# Altium schematic sheet LEDS.SchDoc: LEDBO - LTSN-N213EGBW (LEDS)
size B; Author: Sébastien Gélinas; Organization: SmartHalo; Address1: 5445 de Gaspé; Address2: Montréal, QC; Address3: Canada; Address4: H2T 3B2; Revision: 1; SheetNumber: 4; SheetTotal: 4
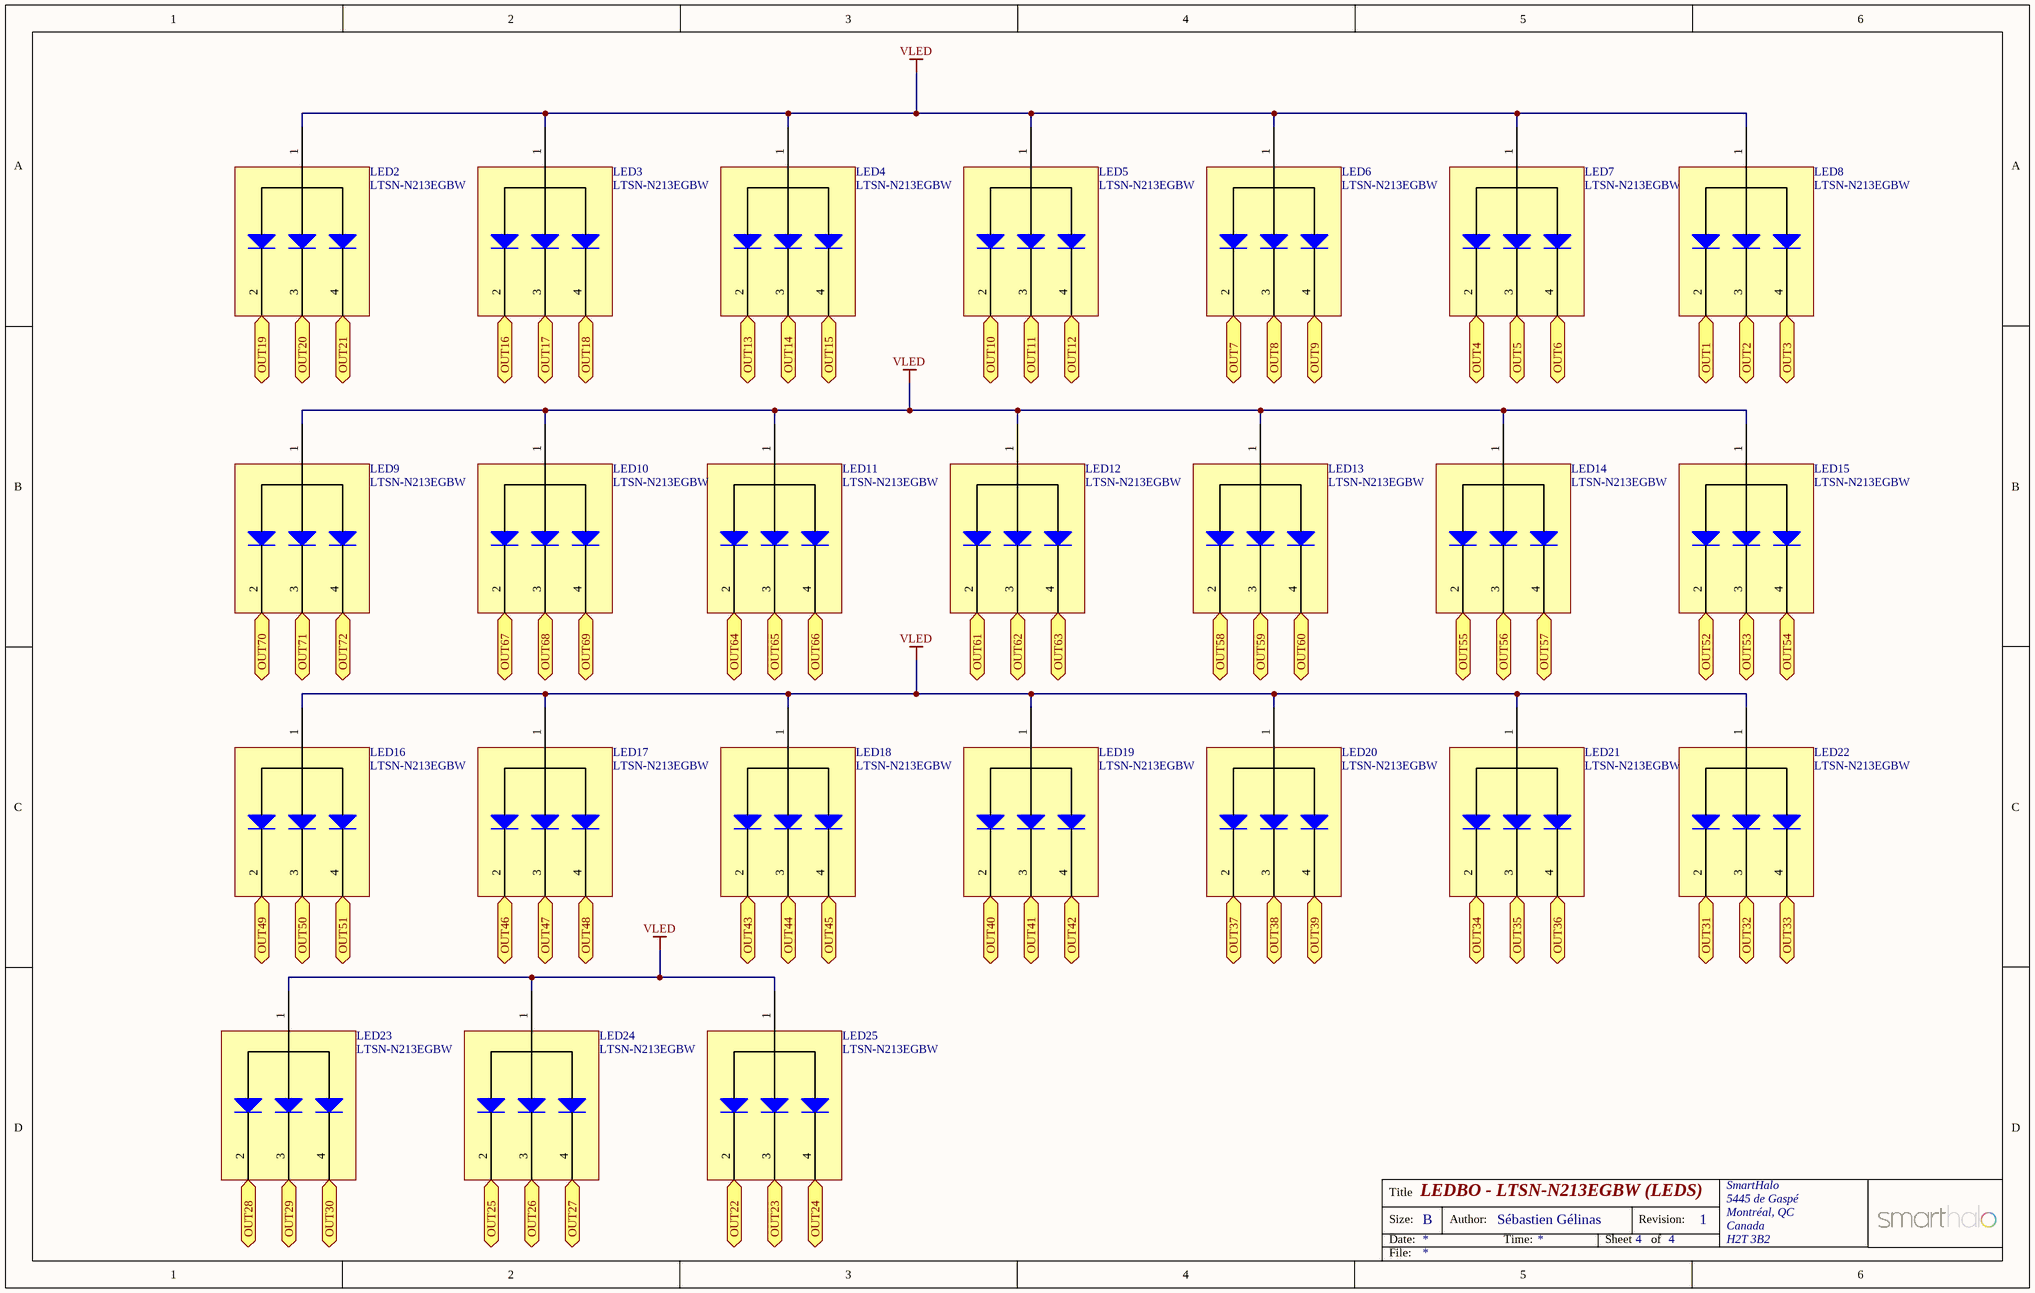
[diagram p0: LEDS.SchDoc]

## Parts
LED2  LTSN-N213EGBW  [LTSN-N213EGBW]
LED3  LTSN-N213EGBW  [LTSN-N213EGBW]
LED4  LTSN-N213EGBW  [LTSN-N213EGBW]
LED5  LTSN-N213EGBW  [LTSN-N213EGBW]
LED6  LTSN-N213EGBW  [LTSN-N213EGBW]
LED7  LTSN-N213EGBW  [LTSN-N213EGBW]
LED8  LTSN-N213EGBW  [LTSN-N213EGBW]
LED9  LTSN-N213EGBW  [LTSN-N213EGBW]
LED10  LTSN-N213EGBW  [LTSN-N213EGBW]
LED11  LTSN-N213EGBW  [LTSN-N213EGBW]
LED12  LTSN-N213EGBW  [LTSN-N213EGBW]
LED13  LTSN-N213EGBW  [LTSN-N213EGBW]
LED14  LTSN-N213EGBW  [LTSN-N213EGBW]
LED15  LTSN-N213EGBW  [LTSN-N213EGBW]
LED16  LTSN-N213EGBW  [LTSN-N213EGBW]
LED17  LTSN-N213EGBW  [LTSN-N213EGBW]
LED18  LTSN-N213EGBW  [LTSN-N213EGBW]
LED19  LTSN-N213EGBW  [LTSN-N213EGBW]
LED20  LTSN-N213EGBW  [LTSN-N213EGBW]
LED21  LTSN-N213EGBW  [LTSN-N213EGBW]
LED22  LTSN-N213EGBW  [LTSN-N213EGBW]
LED23  LTSN-N213EGBW  [LTSN-N213EGBW]
LED24  LTSN-N213EGBW  [LTSN-N213EGBW]
LED25  LTSN-N213EGBW  [LTSN-N213EGBW]

## Ports
OUT1, OUT2, OUT3, OUT4, OUT5, OUT6, OUT7, OUT8, OUT9, OUT10, OUT11, OUT12, OUT13, OUT14, OUT15, OUT16, OUT17, OUT18, OUT19, OUT20, OUT21, OUT22, OUT23, OUT24, OUT25, OUT26, OUT27, OUT28, OUT29, OUT30, OUT31, OUT32, OUT33, OUT34, OUT35, OUT36, OUT37, OUT38, OUT39, OUT40, OUT41, OUT42, OUT43, OUT44, OUT45, OUT46, OUT47, OUT48, OUT49, OUT50, OUT51, OUT52, OUT53, OUT54, OUT55, OUT56, OUT57, OUT58, OUT59, OUT60, OUT61, OUT62, OUT63, OUT64, OUT65, OUT66, OUT67, OUT68, OUT69, OUT70, OUT71, OUT72

## Nets
VLED: LED2.1(Anode) LED3.1(Anode) LED4.1(Anode) LED5.1(Anode) LED6.1(Anode) LED7.1(Anode) LED8.1(Anode) LED9.1(Anode) LED10.1(Anode) LED11.1(Anode) LED12.1(Anode) LED13.1(Anode) LED14.1(Anode) LED15.1(Anode) LED16.1(Anode) LED17.1(Anode) LED18.1(Anode) LED19.1(Anode) LED20.1(Anode) LED21.1(Anode) LED22.1(Anode) LED23.1(Anode) LED24.1(Anode) LED25.1(Anode)
OUT1: LED8.2(Cathode_Red) ; port OUT1
OUT2: LED8.3(Cathode_Green) ; port OUT2
OUT3: LED8.4(Cathode_Blue) ; port OUT3
OUT4: LED7.2(Cathode_Red) ; port OUT4
OUT5: LED7.3(Cathode_Green) ; port OUT5
OUT6: LED7.4(Cathode_Blue) ; port OUT6
OUT7: LED6.2(Cathode_Red) ; port OUT7
OUT8: LED6.3(Cathode_Green) ; port OUT8
OUT9: LED6.4(Cathode_Blue) ; port OUT9
OUT10: LED5.2(Cathode_Red) ; port OUT10
OUT11: LED5.3(Cathode_Green) ; port OUT11
OUT12: LED5.4(Cathode_Blue) ; port OUT12
OUT13: LED4.2(Cathode_Red) ; port OUT13
OUT14: LED4.3(Cathode_Green) ; port OUT14
OUT15: LED4.4(Cathode_Blue) ; port OUT15
OUT16: LED3.2(Cathode_Red) ; port OUT16
OUT17: LED3.3(Cathode_Green) ; port OUT17
OUT18: LED3.4(Cathode_Blue) ; port OUT18
OUT19: LED2.2(Cathode_Red) ; port OUT19
OUT20: LED2.3(Cathode_Green) ; port OUT20
OUT21: LED2.4(Cathode_Blue) ; port OUT21
OUT22: LED25.2(Cathode_Red) ; port OUT22
OUT23: LED25.3(Cathode_Green) ; port OUT23
OUT24: LED25.4(Cathode_Blue) ; port OUT24
OUT25: LED24.2(Cathode_Red) ; port OUT25
OUT26: LED24.3(Cathode_Green) ; port OUT26
OUT27: LED24.4(Cathode_Blue) ; port OUT27
OUT28: LED23.2(Cathode_Red) ; port OUT28
OUT29: LED23.3(Cathode_Green) ; port OUT29
OUT30: LED23.4(Cathode_Blue) ; port OUT30
OUT31: LED22.2(Cathode_Red) ; port OUT31
OUT32: LED22.3(Cathode_Green) ; port OUT32
OUT33: LED22.4(Cathode_Blue) ; port OUT33
OUT34: LED21.2(Cathode_Red) ; port OUT34
OUT35: LED21.3(Cathode_Green) ; port OUT35
OUT36: LED21.4(Cathode_Blue) ; port OUT36
OUT37: LED20.2(Cathode_Red) ; port OUT37
OUT38: LED20.3(Cathode_Green) ; port OUT38
OUT39: LED20.4(Cathode_Blue) ; port OUT39
OUT40: LED19.2(Cathode_Red) ; port OUT40
OUT41: LED19.3(Cathode_Green) ; port OUT41
OUT42: LED19.4(Cathode_Blue) ; port OUT42
OUT43: LED18.2(Cathode_Red) ; port OUT43
OUT44: LED18.3(Cathode_Green) ; port OUT44
OUT45: LED18.4(Cathode_Blue) ; port OUT45
OUT46: LED17.2(Cathode_Red) ; port OUT46
OUT47: LED17.3(Cathode_Green) ; port OUT47
OUT48: LED17.4(Cathode_Blue) ; port OUT48
OUT49: LED16.2(Cathode_Red) ; port OUT49
OUT50: LED16.3(Cathode_Green) ; port OUT50
OUT51: LED16.4(Cathode_Blue) ; port OUT51
OUT52: LED15.2(Cathode_Red) ; port OUT52
OUT53: LED15.3(Cathode_Green) ; port OUT53
OUT54: LED15.4(Cathode_Blue) ; port OUT54
OUT55: LED14.2(Cathode_Red) ; port OUT55
OUT56: LED14.3(Cathode_Green) ; port OUT56
OUT57: LED14.4(Cathode_Blue) ; port OUT57
OUT58: LED13.2(Cathode_Red) ; port OUT58
OUT59: LED13.3(Cathode_Green) ; port OUT59
OUT60: LED13.4(Cathode_Blue) ; port OUT60
OUT61: LED12.2(Cathode_Red) ; port OUT61
OUT62: LED12.3(Cathode_Green) ; port OUT62
OUT63: LED12.4(Cathode_Blue) ; port OUT63
OUT64: LED11.2(Cathode_Red) ; port OUT64
OUT65: LED11.3(Cathode_Green) ; port OUT65
OUT66: LED11.4(Cathode_Blue) ; port OUT66
OUT67: LED10.2(Cathode_Red) ; port OUT67
OUT68: LED10.3(Cathode_Green) ; port OUT68
OUT69: LED10.4(Cathode_Blue) ; port OUT69
OUT70: LED9.2(Cathode_Red) ; port OUT70
OUT71: LED9.3(Cathode_Green) ; port OUT71
OUT72: LED9.4(Cathode_Blue) ; port OUT72

## Notes on the sheet
- Title
- Size:
- Date:
- B
- Author:
- Time:
- Sheet
- Revision:
- of
- File:

## Library data of the parts
LED2-LED25 = LTSN-N213EGBW: LED SMD LTSN-N213EGBW; Manufacturer: LiteOn